# Altium schematic sheet DC-DC модуль +14V.SchDoc
size 209 x 297 mm; DocumentNumber: 3; SheetNumber: 3; SheetTotal: 11; ListNumber: 1
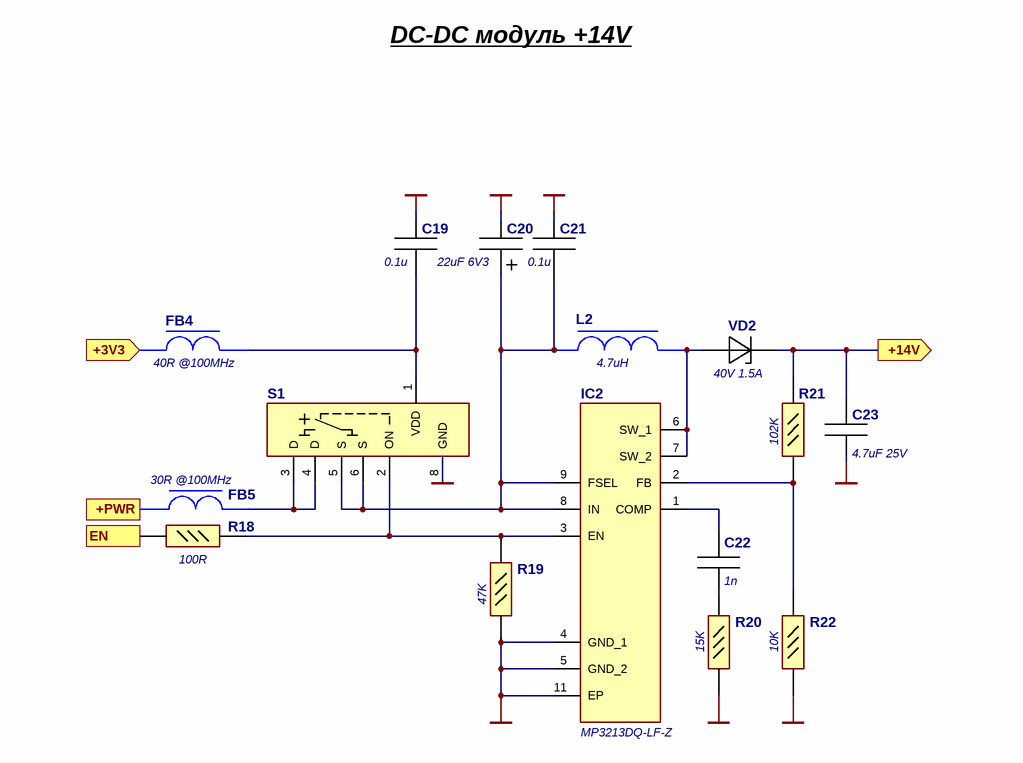
[diagram p0: DC-DC модуль +14V.SchDoc]

## Parts
C19  0.1u  [:CAP0402 100x50x50]
C20  22uF 6V3  [:CAP1206 C3216-18]
C21  0.1u  [:CAP0402 100x50x50]
C22  1n  [:CAP0402 100x50x50]
C23  4.7uF 25V  [:CAP0805 C2012X125]
FB4  40R @100MHz  [:FER MMZ1005Y400CTD25]
FB5  30R @100MHz  [:FER BLM18SP300SN1D]
IC2  MP3213DQ-LF-Z  [:QFN10 P300X300X100-11N-D]
L2  4.7uH  [:IND1210 C3225]
R18  Manufacturer_Part_Number (part 2: value): 100R  [:RES0402]  (hidden comment: RC0402FR-07)
R19  Manufacturer_Part_Number (part 2: value): 47K  [:RES0402]  (hidden comment: RC0402FR-07)
R20  Manufacturer_Part_Number (part 2: value): 15K  [:RES0402]  (hidden comment: RC0402FR-07)
R21  Manufacturer_Part_Number (part 2: value): 102K  [:RES0402]  (hidden comment: RC0402FR-07)
R22  Manufacturer_Part_Number (part 2: value): 10K  [:RES0402]  (hidden comment: RC0402FR-07)
S1  4A 7.8mOhm  [:TRAN SLG59M309V]  (value not drawn)
VD2  40V 1.5A  [:DIODE CST2C]

## Ports
+3V3 (in), +14V (out), +PWR (in), EN (in)

## Nets
GND: C19.1 C20.2 C21.1 C23.1 IC2.4(GND_1) IC2.5(GND_2) IC2.11(EP) R19.1 R20.1 R22.1 S1.8(GND)
+3V3: FB4.2 ; port +3V3
+14V: C23.2 R21.2 VD2.1(K) ; port +14V
+PWR: FB5.1 ; port +PWR
EN: R18.1 ; port EN
NetC19_2: C19.2 FB4.1 S1.1(VDD)
NetC20_1: C20.1(+) C21.2 IC2.8(IN) IC2.9(FSEL) L2.1 S1.5(S) S1.6(S)
NetC22_1: C22.1 R20.2
NetC22_2: C22.2 IC2.1(COMP)
NetFB5_2: FB5.2 S1.3(D) S1.4(D)
NetIC2_2: IC2.2(FB) R21.1 R22.2
NetIC2_3: IC2.3(EN) R18.2 R19.2 S1.2(ON)
NetIC2_6: IC2.6(SW_1) IC2.7(SW_2) L2.2 VD2.2(A)

## Notes on the sheet
- DC-DC модуль +14V
- Подп. и дата
- Инв. № дубл.
- Взам. инв. №
- Инв. № подл.
- Лист
- Изм.
- № докум.
- Подп.
- Дата
- Копировал
- Формат А4

## Library data of the parts
C19 C21 = GRM155R71E104KE14J: ±10% 25V Ceramic Capacitor X7R 0402 (1005 Metric); Manufacturer_Name: Murata Electronics; Short Description: 0402 0.1uF 25V; Datasheet Link: http://www.murata.com/~/media/webrenewal/support/library/catalog/products/capacitor/mlcc/c02e.pdf; Height: 0.55mm; Manufacturer_Part_Number: GRM155R71E104KE14J; Mouser Part Number: 81-GRM155R71E104KE4J; Mouser Price/Stock: https://www.mouser.co.uk/ProductDetail/Murata-Electronics/GRM155R71E104KE14J?qs=hNud%2FORuBR2EQtvG2InwAQ%3D%3D; Arrow Part Number: GRM155R71E104KE14J; Arrow Price/Stock: https://www.arrow.com/en/products/grm155r71e104ke14j/murata-manufacturing
C20 = TPSA226K006R0300: 22uF Molded Tantalum Capacitors 6.3V 1206 (3216 Metric) 300mOhm @ 100kHz; Manufacturer_Name: AVX; Short Description: 1206 22uF 6V3; Manufacturer_Part_Number: TPSA226K006R0300
C22 = GRM1555C1H102JA01J: ±5% 50V Ceramic Capacitor C0G, NP0 0402 (1005 Metric); Manufacturer_Name: Murata Electronics; Short Description: 0402 1n 50V; Height: 0.55mm; Manufacturer_Part_Number: GRM1555C1H102JA01J
C23 = GRM21BZ71E475KE15L: CAP CER 4.7uF 25V X7R 0805; Manufacturer_Name: Murata Electronics; Short Description: 0805 4.7uF 25V; Datasheet Link: https://search.murata.co.jp/Ceramy/image/img/A01X/G101/ENG/GRM21BZ71E475KE15-01.pdf; Height: 1.45mm; Manufacturer_Part_Number: GRM21BZ71E475KE15L
FB4 = MMZ1005Y400CTD25: 40 Ohms @ 100MHz 1 Signal Line Ferrite Bead 0402 (1005 Metric) 550mA 100mOhm; Manufacturer_Name: TDK; Short Description: 0402 40R @100MHz; Datasheet Link: https://www.arrow.com/en/products/mmz1005y400ctd25/tdk; Height: 0.55mm; Manufacturer_Part_Number: MMZ1005Y400CTD25; Mouser Part Number: 810-MMZ1005Y400CTD25; Mouser Price/Stock: https://www.mouser.com/Search/Refine.aspx?Keyword=810-MMZ1005Y400CTD25; Arrow Part Number: MMZ1005Y400CTD25; Arrow Price/Stock: https://www.arrow.com/en/products/mmz1005y400ctd25/tdk
FB5 = BLM18SP300SN1D: 30 Ohms @ 100MHz 1 Power Line Ferrite Bead 0603 (1608 Metric) 6A 8mOhm; Manufacturer_Name: Murata Electronics; Short Description: 0603 30R @100MHz; Datasheet Link: http://www.murata.com/~/media/webrenewal/support/library/catalog/products/emc/emifil/c31e.ashx?la=en-gb; Height: 0.95mm; Manufacturer_Part_Number: BLM18SP300SN1D; Mouser Part Number: 81-BLM18SP300SN1D; Mouser Price/Stock: https://www.mouser.co.uk/ProductDetail/Murata-Electronics/BLM18SP300SN1D/?qs=W%2FMpXkg%252BdQ4o%252BOP%252B6m8FYA%3D%3D
IC2 = MP3213DQ-LF-Z: DC/DC Converter / 3...22V 3.5A; Manufacturer_Name: Monolithic Power Systems (MPS); Datasheet Link: https://www.monolithicpower.com/en/documentview/productdocument/index/version/2/document_type/Datasheet/lang/en/sku/MP3213/document_id/1111; Height: 1mm; Manufacturer_Part_Number: MP3213DQ-LF-Z; Mouser Part Number: 946-MP3213DQLFZ; Mouser Price/Stock: https://www.mouser.co.uk/ProductDetail/Monolithic-Power-Systems-MPS/MP3213DQ-LF-Z?qs=rC7bBWoQAAkNszTDCx8XYw%3D%3D; Short Description: 3...22V
L2 = CBC3225T4R7MR: 4.7µH Unshielded Wirewound Inductor 1.01A 130mOhm Max 1210 (3225 Metric) / Current - Saturation (Isat) 1.25A / Current Rating (Amps) 1.01A / Frequency - Self Resonant 70MHz; Manufacturer_Name: Taiyo Yuden; Short Description: 4.7uH 1A 130mOhm; Manufacturer_Part_Number: CBC3225T4R7MR
R18-R22 = RC0402FR-07: Resistor 0402 1% 1/16W / Value Range: 1Ω ... 10 MΩ / Value Example: / 0R = 0Ω / 97R6 = 97.6Ω / 9K76 = 9760Ω / 1M = 1,000,000Ω; Manufacturer_Name: YAGEO; Manufacturer_Part_Number (part 3: after value): L; Short Description: 0402 1%; Datasheet Link: http://www.yageo.com/documents/recent/PYu-RC0402_51_RoHS_L_6_r.pdf; Height: 0.4mm; Manufacturer_Part_Number: RC0402FR-07; Parameter 1: *
S1 = SLG59M309V: Power Switch/Driver 1:1 N-Channel 4A  7.8mOhm 8-FC-TDFN (1.5x2); Manufacturer_Name: Dialog Semiconductor GmbH; Manufacturer_Part_Number: SLG59M309V
VD2 = CCS15S40,L3F: Diode Schottky 40V 1.5A / @If 550mV @ 1.5A / @Vr 200µA @ 40V; Manufacturer_Name: Toshiba; Short Description: 0603 40V 1.5A; Manufacturer_Part_Number: CCS15S40,L3F